# EasyEDA schematic ESPTools.json
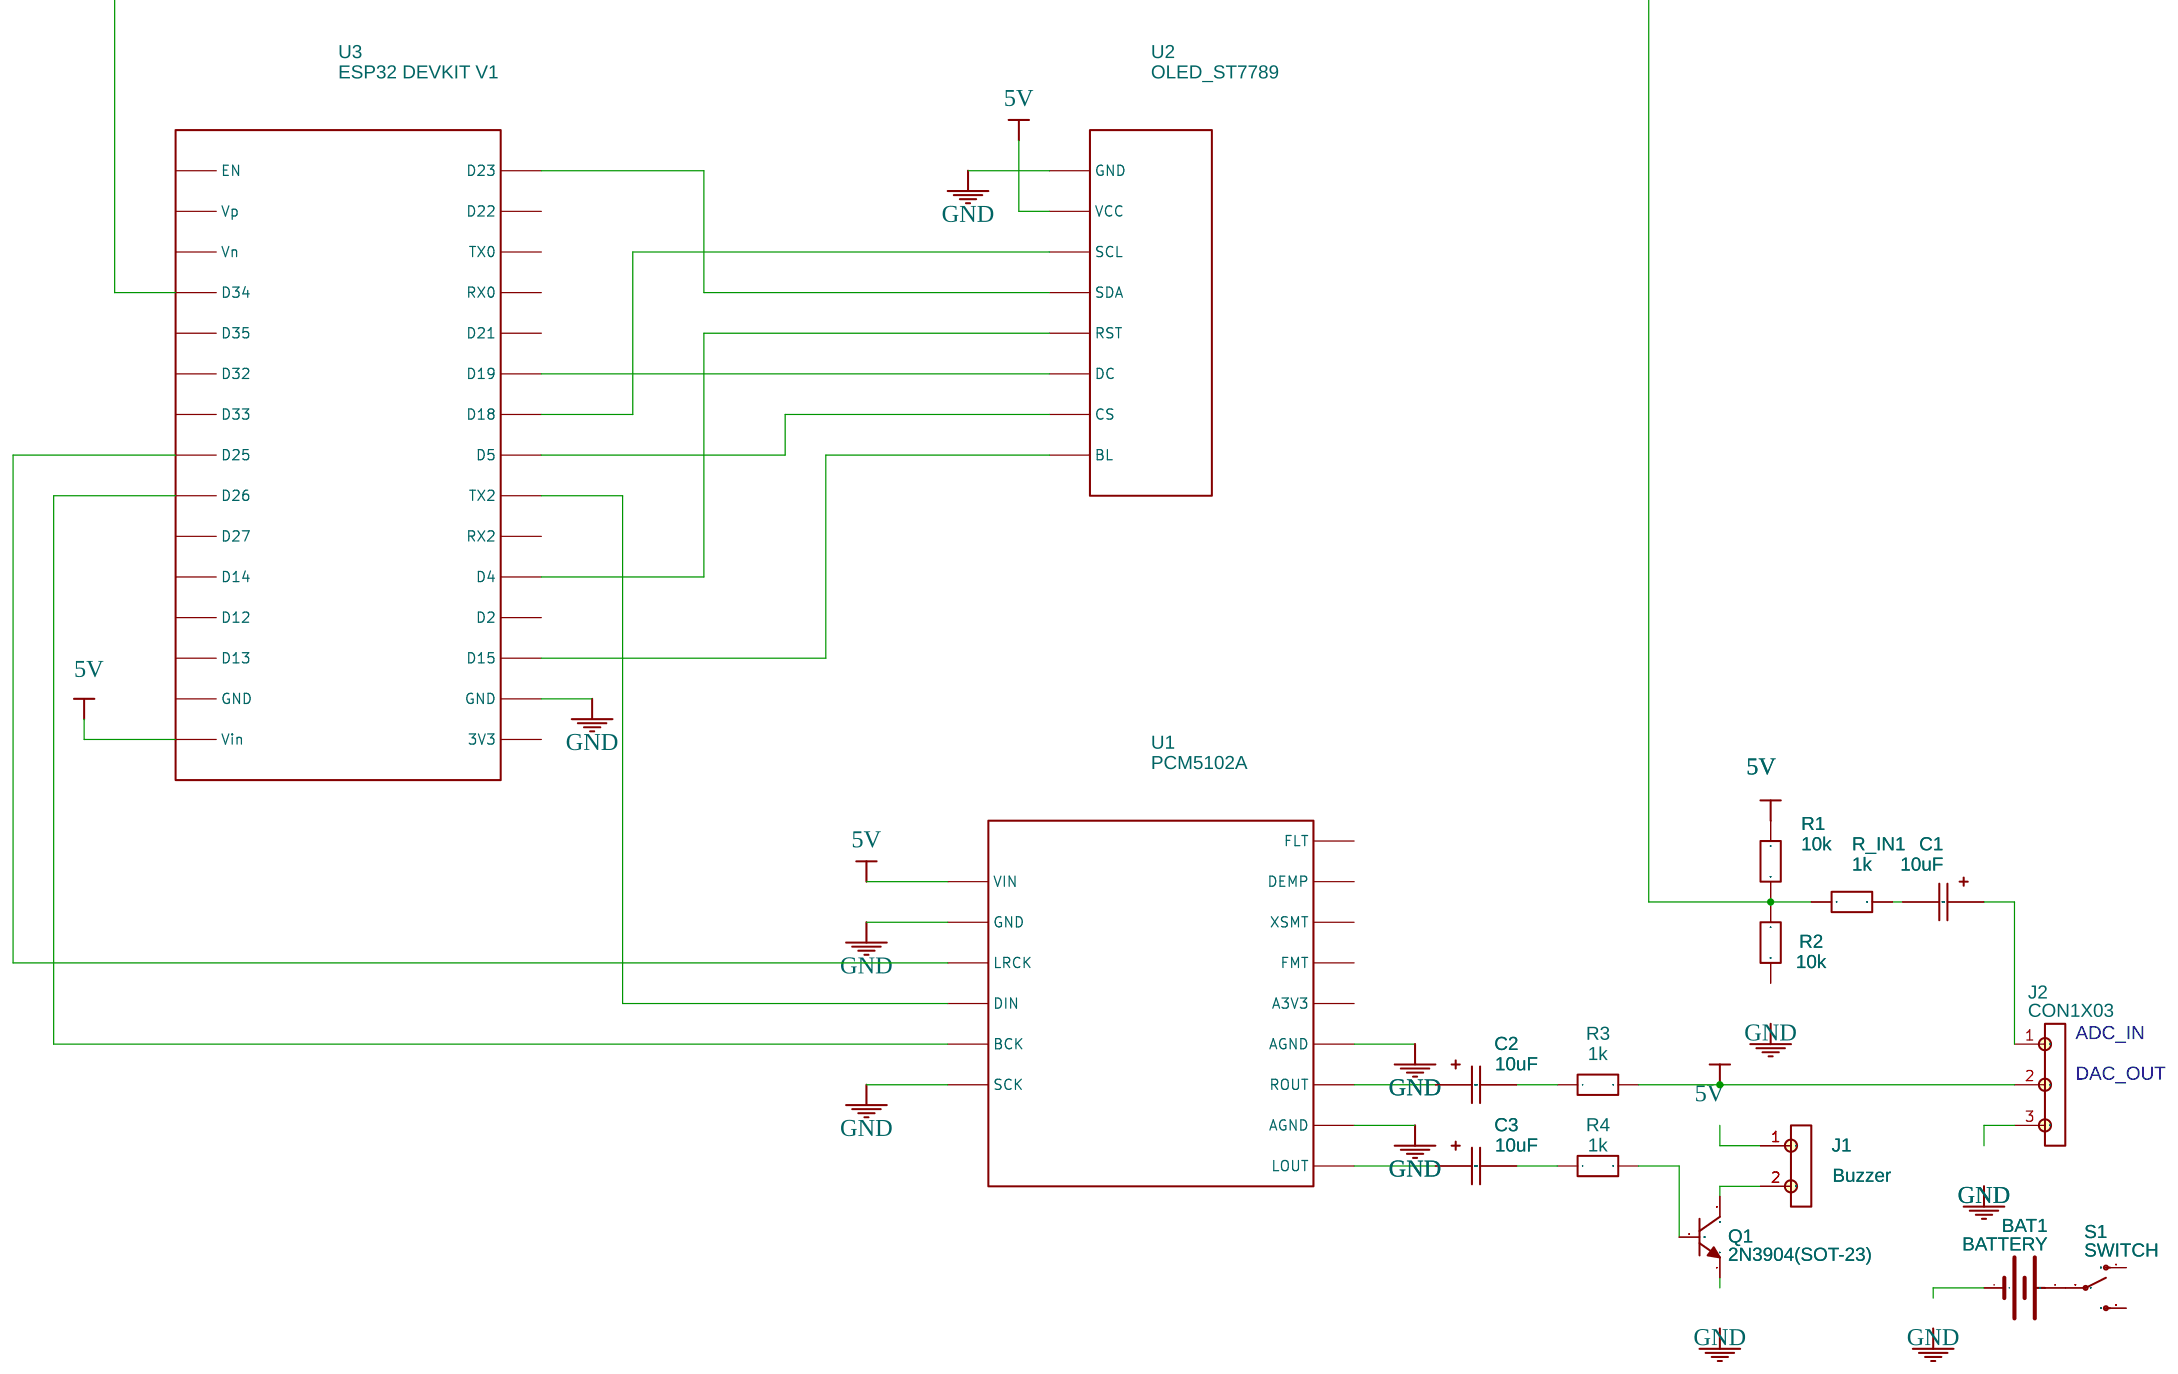
[diagram p0: schematic sheet]

## Parts
BAT1  BATTERY  [LIPO-110-TABS]
C1  10uF  [CAP-TH_BD6.0-P2.50-D1.0-FD]
C2  10uF  [CAP-TH_BD6.0-P2.50-D1.0-FD]
C3  10uF  [CAP-TH_BD6.0-P2.50-D1.0-FD]
J1  Buzzer  [CONN-TH_2P-P5.00-V-F_DB301R-5.0-2P]
J2  CON1X03  [CON--1X03]
Q1  2N3904(SOT-23)  [SOT-23-3_L2.9-W1.3-P1.90-LS2.4-TR]
R1  10k  [R0603]
R2  10k  [R0603]
R3  1k  [R0603]
R4  1k  [R0603]
R_IN1  1k  [R0603]
S1  SWITCH  [SWITCH-SPDT]
U1  PCM5102A  [PCM5102A_MODULE]
U2  OLED_ST7789  [GMT024-8PIN]
U3  ESP32 DEVKIT V1  [ESP32-DEVKITV1]

## Library data of the parts
BAT1 = BATTERY: Contributor: SparkFun
J1 = CON1X02: Contributor: KiCad
J2 = CON1X03: Contributor: KiCad
Q1 = 2N3904(SOT-23): Supplier: LCSC; Manufacturer: KEC; Manufacturer Part: 2n3904S-RTK/PS; Supplier Part: C18536; Paste Type: SOT-23; Contributor: LCEDA_Lib
S1 = SWITCH-SPSTPTH: SPST Switch; Contributor: Pinoccio

## Nets
5V: C1.(2) C2.(2) C3.(2) J2.1 J2.2 Q1.2(B) R1.(2) R2.(2) R3.(2) R4.(2) R_IN1.(2) U1.(LOUT) U2.(BL) U3.(EN)
Net-(BAT1-+): BAT1.+ S1.2(P)
Net-(J1-2): J1.2 Q1.3(C)

Not connected (* = marked no-connect by the designer): BAT1 -; J1 1; J2 3; Q1 1(E); S1 1(O) 3(S)

## Notes on the sheet
- ADC_IN
- DAC_OUT
